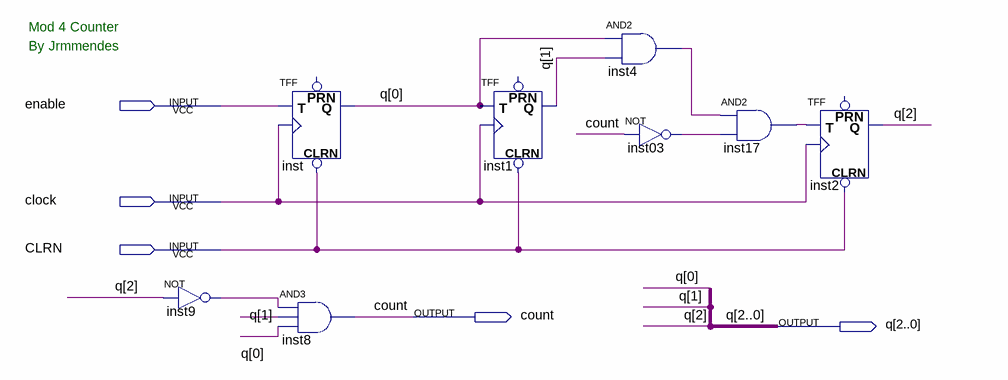
[diagram p0: schematic sheet]
// Quartus schematic mod_4_counter.bdf as structural Verilog: 8 symbols, 5 pins
module mod_4_counter (
  input  enable,
  input  clock,
  input  CLRN,
  output count,
  output [2:0] q
);

  wire inst03_out, inst4_out, inst9_out, inst17_out;

  not inst9 (inst9_out, q[2]);
  TFF inst (.CLRN(CLRN), .T(enable), .CLK(clock), .Q(q[0]));  // open: PRN
  and inst8 (count, inst9_out, q[1], q[0]);
  TFF inst1 (.CLRN(CLRN), .T(q[0]), .CLK(clock), .Q(q[1]));  // open: PRN
  and inst4 (inst4_out, q[0], q[1]);
  not inst03 (inst03_out, count);
  and inst17 (inst17_out, inst4_out, inst03_out);
  TFF inst2 (.CLRN(CLRN), .T(inst17_out), .CLK(clock), .Q(q[2]));  // open: PRN

  // Notes on the sheet:
  //   Mod 4 Counter
  //   By Jrmmendes
endmodule
